# Altium schematic sheet Hailo 8.SchDoc
size A3; SheetNumber: 5; SheetTotal: 6
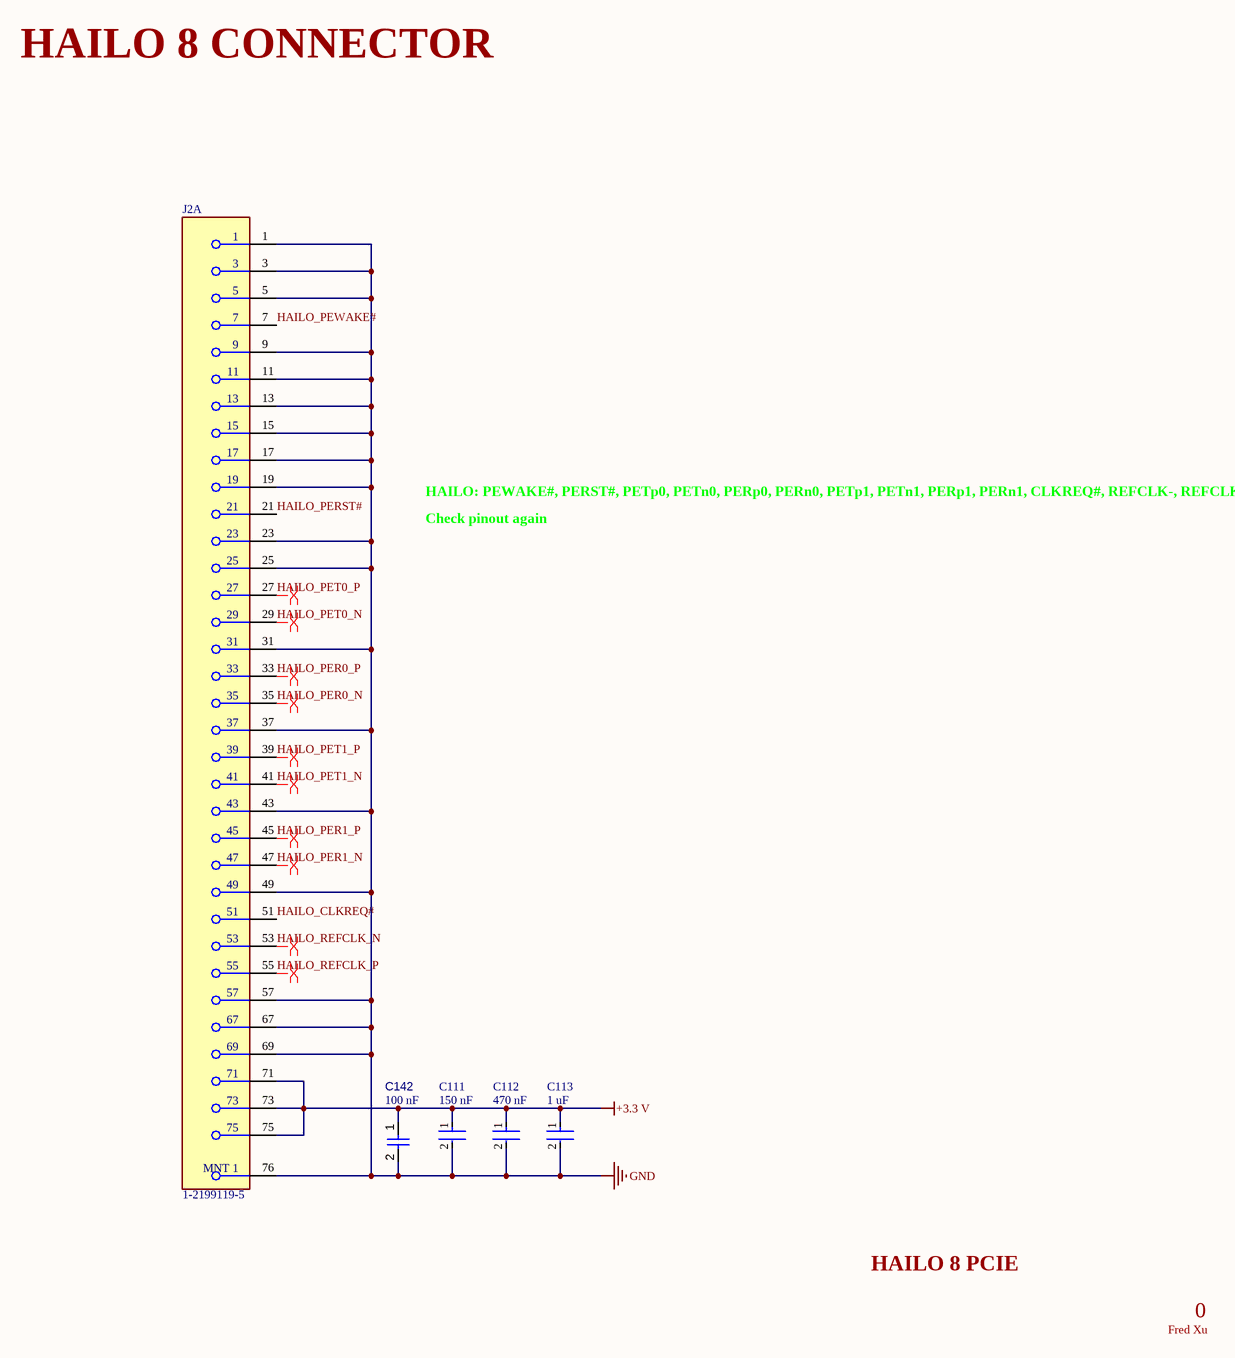
[diagram p0: Hailo 8.SchDoc]

## Parts
C111  150 nF  [FP-GCM155-0_05-MFG]
C112  470 nF  [FP-GRM155-0_05-IPC_B]
C113  1 uF  [FP-GCM155-0_2-MFG]
C142  value 100 nF  [CAPC1005X56X25LL10T15]  (hidden comment: 0.1 uF)
J2  1-2199119-5  [FP-1-2199119-5-MFG]  (part A of 2)

## Nets
+3.3 V: C111.1 C112.1 C113.1 C142.1 J2.71 J2.73 J2.75
GND: C111.2 C112.2 C113.2 C142.2 J2.1 J2.3 J2.5 J2.9 J2.11 J2.13 J2.15 J2.17 J2.19 J2.23 J2.25 J2.31 J2.37 J2.43 J2.49 J2.57 J2.67 J2.69 J2.76(MNT_1)
HAILO_CLKREQ#: J2.51
HAILO_PER0_N: J2.35
HAILO_PER0_P: J2.33
HAILO_PER1_N: J2.47
HAILO_PER1_P: J2.45
HAILO_PERST#: J2.21
HAILO_PET0_N: J2.29
HAILO_PET0_P: J2.27
HAILO_PET1_N: J2.41
HAILO_PET1_P: J2.39
HAILO_PEWAKE#: J2.7
HAILO_REFCLK_N: J2.53
HAILO_REFCLK_P: J2.55

## Layout directives
differential pair: HAILO_PER0_N, HAILO_PER0_P, HAILO_PER1_N, HAILO_PER1_P, HAILO_PET0_N, HAILO_PET0_P, HAILO_PET1_N, HAILO_PET1_P, HAILO_REFCLK_N, HAILO_REFCLK_P

## Notes on the sheet
- HAILO 8 CONNECTOR
- HAILO: PEWAKE#, PERST#, PETp0, PETn0, PERp0, PERn0, PETp1, PETn1, PERp1, PERn1, CLKREQ#, REFCLK-, REFCLK+
- Check pinout again
- HAILO 8 PCIE
- Fred Xu
- 0

## Library data of the parts
C111 = CMP-06035-038659-1: Ceramic Capacitor for Automotive 150nF ±20% 16VDC X7R 0402 Paper T/R
C112 = CMP-06035-008909-1: Chip Multilayer Ceramic Capacitors for General Purpose, 0402, 0.47uF, X7R, 15%, 20%, 10V; Capacitance: 470nF; Length: 1mm; Thickness: 500um; Dielectric: X7R; Voltage Rating (DC): 10V; Width: 500um; Tolerance: 20%
C113 = CMP-06035-019453-1: Ceramic Capacitor for Automotive 1uF ±20% 10VDC X7S 0402 Paper T/R
C142 = CMP-001-00001-6: Chip Capacitor, 0.1 uF, +/- 5%, 16 V, 0402 (1005 Metric); Capacitor Type: Ceramic; Voltage Rating: 16V; Max Operating Temperature: 125°C; Min Operating Temperature: -55°C; Case/Package: 0402; Mounting Technology: SM; Pins: 2; Tolerance: 5%; RoHS Compliant: True
J2 = CMP-03365-000005-1: CONN M.2 FEMALE 67POS 0.020 GOLD; Number of Contacts: 67; Row Spacing: 7.55mm; Contact Current Rating: 500mA; PCB Mounting Orientation: Right Angle; Pitch: 0.5mm; ELV: Compliant; Package Quantity: 1; Width: 8.7mm; Contact Plating: Gold; Contact Material: Copper Alloy; Housing Material: Thermoplastic; Housing Color: Black; Orientation: Right Angle; Length: 0.862inch; Min Operating Temperature: -40°C; Radiation Hardening: No; RoHS Compliant: Yes; Mount: Surface Mount; Number of Rows: 2; Color: Black; Termination: Solder; Insulation Material: Thermoplastic; Number of Positions: 67; Height: 3.2mm; Gender: Female; Packaging: Tape and Reel; Max Operating Temperature: 80°C